# EAGLE design festBin (EAGLE 6.3)
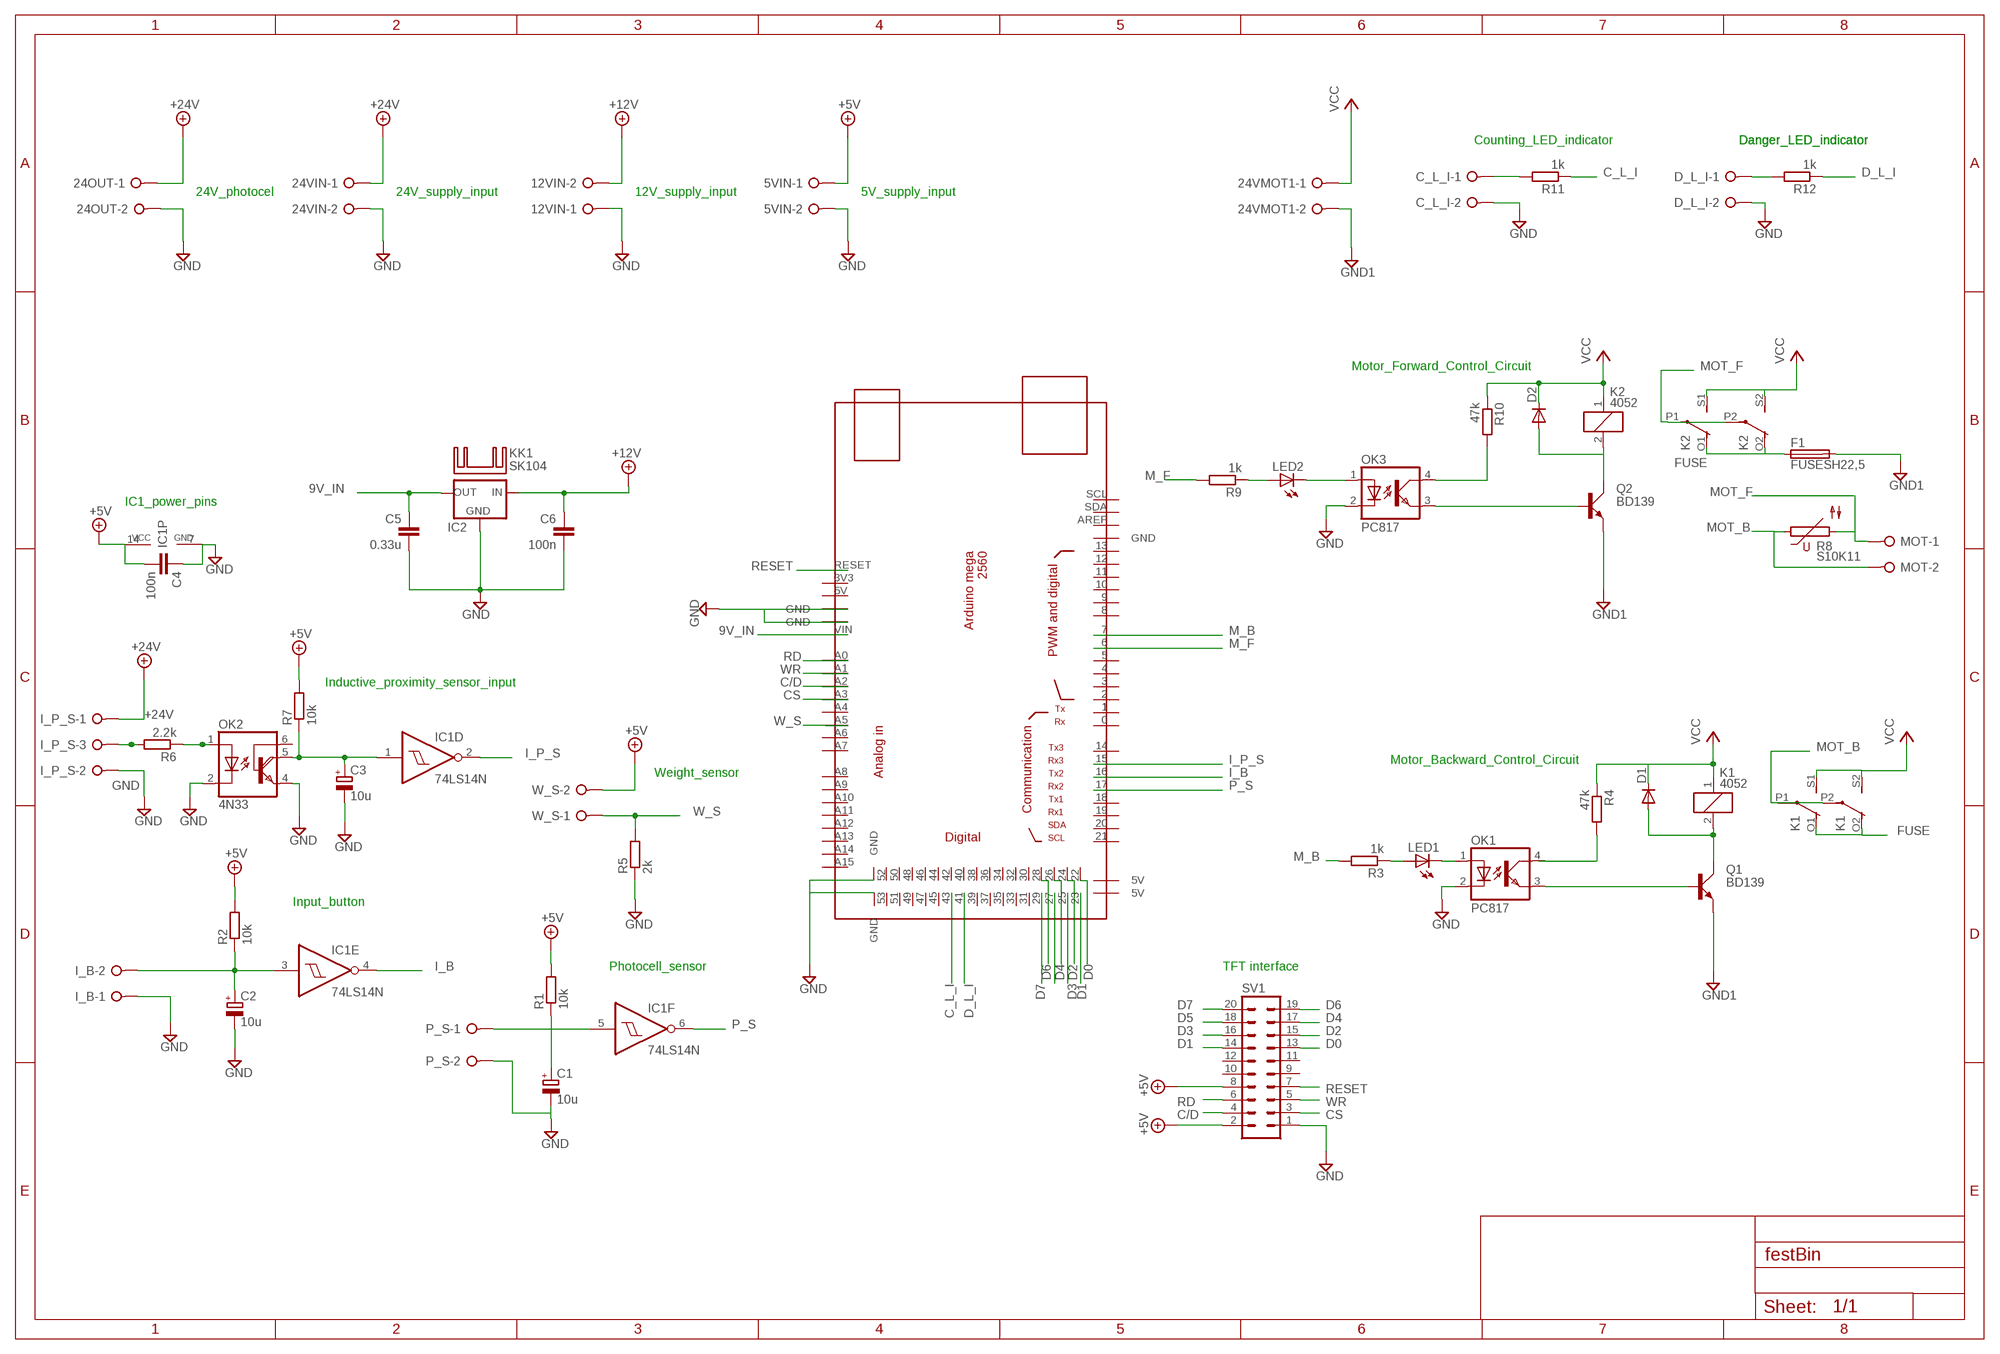
[diagram p0: schematic, sheet 1]

## Parts
5VIN  W237-02P  [W237-132]
12VIN  W237-02P  [W237-132]
24OUT  W237-02P  [W237-132]
24VIN  W237-02P  [W237-132]
24VMOT1  W237-02P  [W237-132]
C1  10u  CPOL-EUE2.5-6  [E2,5-6]
C2  10u  CPOL-EUE2.5-6  [E2,5-6]
C3  10u  CPOL-EUE2.5-6  [E2,5-6]
C4  100n  C-EU050-024X044  [C050-024X044]
C5  0.33u  C-EU050-024X044  [C050-024X044]
C6  100n  C-EU050-024X044  [C050-024X044]
C_L_I  W237-02P  [W237-132]
D1  DIODE-DO41-10  [DO41-10]
D2  DIODE-DO41-10  [DO41-10]
D_L_I  W237-02P  [W237-132]
F1  FUSESH22,5  [SH22,5]
I_B  W237-02P  [W237-132]
I_P_S  W237-3E  [W237-3E]
IC1  74LS14N  [DIL14]
IC2  78XXS  [78XXS]
K1  4052  [F4052]
K2  4052  [F4052]
KK1  SK104  [SK104]
LED1  LED3MM  [LED3MM]
LED2  LED3MM  [LED3MM]
MOT  W237-02P  [W237-132]
OK1  PC817  [DIL04]
OK2  4N33  [DIL06]
OK3  PC817  [DIL04]
P_S  W237-02P  [W237-132]
Q1  BD139  [TO126AV]
Q2  BD139  [TO126AV]
R1  10k  R-EU_0207/10  [0207/10]
R2  10k  R-EU_0207/10  [0207/10]
R3  1k  R-EU_0207/10  [0207/10]
R4  47k  R-EU_0207/10  [0207/10]
R5  2k  R-EU_0207/10  [0207/10]
R6  2.2k  R-EU_0207/10  [0207/10]
R7  10k  R-EU_0207/10  [0207/10]
R8  S10K11  [S10K11]
R9  1k  R-EU_0207/10  [0207/10]
R10  47k  R-EU_0207/10  [0207/10]
R11  1k  R-EU_0207/10  [0207/10]
R12  1k  R-EU_0207/10  [0207/10]
SV1  ML20  [ML20]
U$1  MEGA_DEVICE  [MEGABOX]
W_S  W237-02P  [W237-132]

## Nets
9V_IN: C5.1 IC2.OUT U$1.VIN
+5V: 5VIN.1 C4.2 IC1.14(P:VCC) R1.2 R2.2 R7.2 SV1.2 SV1.8 W_S.2
+12V: 12VIN.2 C6.1 IC2.IN
+24V: 24OUT.1 24VIN.1 I_P_S.1
C/D: SV1.4 U$1.A2
C_L_I: R11.1 U$1.43
CS: SV1.3 U$1.A3
D0: SV1.13 U$1.22
D1: SV1.14 U$1.23
D2: SV1.15 U$1.24
D3: SV1.16 U$1.25
D4: SV1.17 U$1.26
D5: SV1.18 U$1.27
D6: SV1.19 U$1.28
D7: SV1.20 U$1.29
D_L_I: R12.1 U$1.41
FUSE: F1.1 K1.O1(2:O) K1.O2(3:O) K2.O1(2:O) K2.O2(3:O)
GND: 5VIN.2 12VIN.1 24OUT.2 24VIN.2 C1.- C2.- C3.- C4.1 C5.2 C6.2 C_L_I.2 D_L_I.2 I_B.1 I_P_S.2 IC1.7(P:GND) IC2.GND OK1.2(C) OK2.2(C) OK2.4(E) OK3.2(C) P_S.2 R5.1 SV1.1 U$1.GND@2(GND) U$1.GND@3(GND) U$1.GND@6(GND) U$1.GND@7(GND)
GND1: 24VMOT1.2 F1.2 Q1.E Q2.E
I_B: IC1.4(E:O) U$1.16
I_P_S: IC1.2(D:O) U$1.15
M_B: R3.2 U$1.7
M_F: R9.2 U$1.6
MOT_B: K1.P1(2:P) K1.P2(3:P) MOT.2 R8.1
MOT_F: K2.P1(2:P) K2.P2(3:P) MOT.1 R8.2
N$1: I_P_S.3 R6.2
N$2: C1.+ IC1.5(F:I) P_S.1 R1.1
N$3: C_L_I.1 R11.2
N$4: D_L_I.1 R12.2
N$5: C2.+ I_B.2 IC1.3(E:I) R2.1
N$6: LED2.A R9.1
N$7: LED1.A R3.1
N$10: OK3.4(COL) R10.2
N$11: OK1.3(EMIT) Q1.B
N$12: D2.A K2.2 Q2.C
N$18: LED1.K(C) OK1.1(A)
N$19: LED2.K(C) OK3.1(A)
N$21: OK1.4(COL) R4.2
N$23: D1.A K1.2 Q1.C
N$24: OK3.3(EMIT) Q2.B
N$25: OK2.1(A) R6.1
N$26: C3.+ IC1.1(D:I) OK2.5(COL) R7.1
P_S: IC1.6(F:O) U$1.17
RD: SV1.6 U$1.A0
RESET: SV1.7 U$1.RESET
VCC: 24VMOT1.1 D1.C D2.C K1.1 K1.S1(2:S) K1.S2(3:S) K2.1 K2.S1(2:S) K2.S2(3:S) R4.1 R10.1
W_S: R5.2 U$1.A5 W_S.1
WR: SV1.5 U$1.A1
Unconnected: IC1.8(C:O) IC1.9(C:I) IC1.10(B:O) IC1.11(B:I) IC1.12(A:O) IC1.13(A:I) OK2.6(B) SV1.9 SV1.10 SV1.11 SV1.12 U$1.0 U$1.1 U$1.2 U$1.3 U$1.3V3 U$1.4 U$1.5 U$1.5V U$1.8 U$1.9 U$1.10 U$1.11 U$1.12 U$1.13 U$1.14 U$1.18 U$1.19 U$1.20 U$1.21 U$1.30 U$1.31 U$1.32 U$1.33 U$1.34 U$1.35 U$1.36 U$1.37 U$1.38 U$1.39 U$1.40 U$1.42 U$1.44 U$1.45 U$1.46 U$1.47 U$1.48 U$1.49 U$1.50 U$1.51 U$1.52 U$1.53 U$1.A4 U$1.A6 U$1.A7 U$1.A8 U$1.A9 U$1.A10 U$1.A11 U$1.A12 U$1.A13 U$1.A14 U$1.A15 U$1.AREF U$1.GND@1(GND) U$1.GND@4(5V) U$1.GND@5(5V) U$1.SCL U$1.SDA

## Notes on the sheet
- Counting_LED_indicator | Danger_LED_indicator | Danger_LED_indicator
- 24V_photocel | 24V_supply_input | 12V_supply_input | 5V_supply_input
- Motor_Forward_Control_Circuit
- IC1_power_pins
- Inductive_proximity_sensor_input
- Motor_Backward_Control_Circuit
- Weight_sensor
- Input_button
- Photocell_sensor | TFT interface

## Library data of the parts
5VIN 12VIN 24OUT 24VIN 24VMOT1 C_L_I D_L_I I_B MOT P_S W_S = con-wago-508:W237-02P: WAGO SREW CLAMP; OC_FARNELL: unknown; OC_NEWARK: unknown
C1-C3 = rcl:CPOL-EU: POLARIZED CAPACITOR, European symbol
C4-C6 = rcl:C-EU: CAPACITOR, European symbol
D1 D2 = diode:DIODE-: DIODE
F1 = fuse:FUSE: Fuse; OC_FARNELL: unknown; OC_NEWARK: unknown
I_P_S = con-wago-508:W237-3E: WAGO SREW CLAMP; OC_FARNELL: unknown; OC_NEWARK: unknown
IC1 = 74xx-eu:74*14: Hex schmitt trigger INVERTER
IC2 = v-reg:78XXS: VOLTAGE REGULATOR
K1 K2 = relay:4052: RELAY 2 x switch, Finder; OC_FARNELL: unknown; OC_NEWARK: unknown
KK1 = heatsink:SK104: HEATSINK manufacturer Fischer/distributor Buerklin
LED1 LED2 = led:LED: LED OSRAM: - CHIPLED LG R971, LG N971, LY N971, LG Q971, LY Q971, LO R971, LY R971 LH N974, LH R974 LS Q976, LO Q976, LY Q976 LO Q996 - Hyper CHIPLED LW Q18S LB Q993, LB Q99A, LB R99A - SideLED LS A670, LO A670, LY A670, LG A670, LP A670 LB A673, LV A673, LT A673, LW A673 LH A674 LY A675 LS A676, LA A676, LO A676, LY A676, LW A676 LS A679, LY A679, LG A679 - Hyper Micro SIDELED® LS Y876, LA Y876, LO Y876, LY Y876 LT Y87S - SmartLED LW L88C, LW L88S LB L89C, LB L89S, LG L890 LS L89K, LO L89K, LY L89K LS L896, LA L896, LO L896, LY L896 - TOPLED LS T670, LO T670, LY T670, LG T670, LP T670 LSG T670, LSP T670, LSY T670, LOP T670, LYG T670 LG T671, LOG T671, LSG T671 LB T673, LV T673, LT T673, LW T673 LH T674 LS T676, LA T676, LO T676, LY T676, LB T676, LH T676, LSB T676, LW T676 LB T67C, LV T67C, LT T67C, LS T67K, LO T67K, LY T67K, LW E67C LS E67B, LA E67B, LO E67B, LY E67B, LB E67C, LV E67C, LT E67C LW T67C LS T679, LY T679, LG T679 LS T770, LO T770, LY T770, LG T770, LP T770 LB T773, LV T773, LT T773, LW T773 LH T774 LS E675, LA E675, LY E675, LS T675 LS T776, LA T776, LO T776, LY T776, LB T776 LHGB T686 LT T68C, LB T68C - Hyper Mini TOPLED® LB M676 - Mini TOPLED Santana® LG M470 LS M47K, LO M47K, LY M47K Source: http://www.osram.convergy.de LUXEON: - LUMILED® LXK2-PW12-R00, LXK2-PW12-S00, LXK2-PW14-U00, LXK2-PW14-V00 LXK2-PM12-R00, LXK2-PM12-S00, LXK2-PM14-U00 LXK2-PE12-Q00, LXK2-PE12-R00, LXK2-PE12-S00, LXK2-PE14-T00, LXK2-PE14-U00 LXK2-PB12-K00, LXK2-PB12-L00, LXK2-PB12-M00, LXK2-PB14-N00, LXK2-PB14-P00, LXK2-PB14-Q00 LXK2-PR12-L00, LXK2-PR12-M00, LXK2-PR14-Q00, LXK2-PR14-R00 LXK2-PD12-Q00, LXK2-PD12-R00, LXK2-PD12-S00 LXK2-PH12-R00, LXK2-PH12-S00 LXK2-PL12-P00, LXK2-PL12-Q00, LXK2-PL12-R00 Source: www.luxeon.com KINGBRIGHT: KA-3528ASYC Source: www.kingbright.com
OK1 OK3 = optocoupler:PC817: SHARP OPTO COUPLER; MPN: PC817X4J000F; OC_FARNELL: 9707727; OC_NEWARK: 97K7059
OK2 = optocoupler:4N33: MOTOROLA OPTO COUPLER; MF: VISHAY/TELEFUNKEN; MPN: 4N33; OC_FARNELL: 1469601; OC_NEWARK: 88K1390
Q1 Q2 = transistor-power:BD139: NPN TRANSISTOR
R1-R7 R9-R12 = rcl:R-EU_: RESISTOR, European symbol
R8 = varistor:S10K11: VARISTOR
SV1 = N__con-harting-ml:ML20: HARTING; OC_FARNELL: unknown; OC_NEWARK: unknown
U$1 = ArduinoMegaSymbol:MEGA_DEVICE: mega card as device

## Board
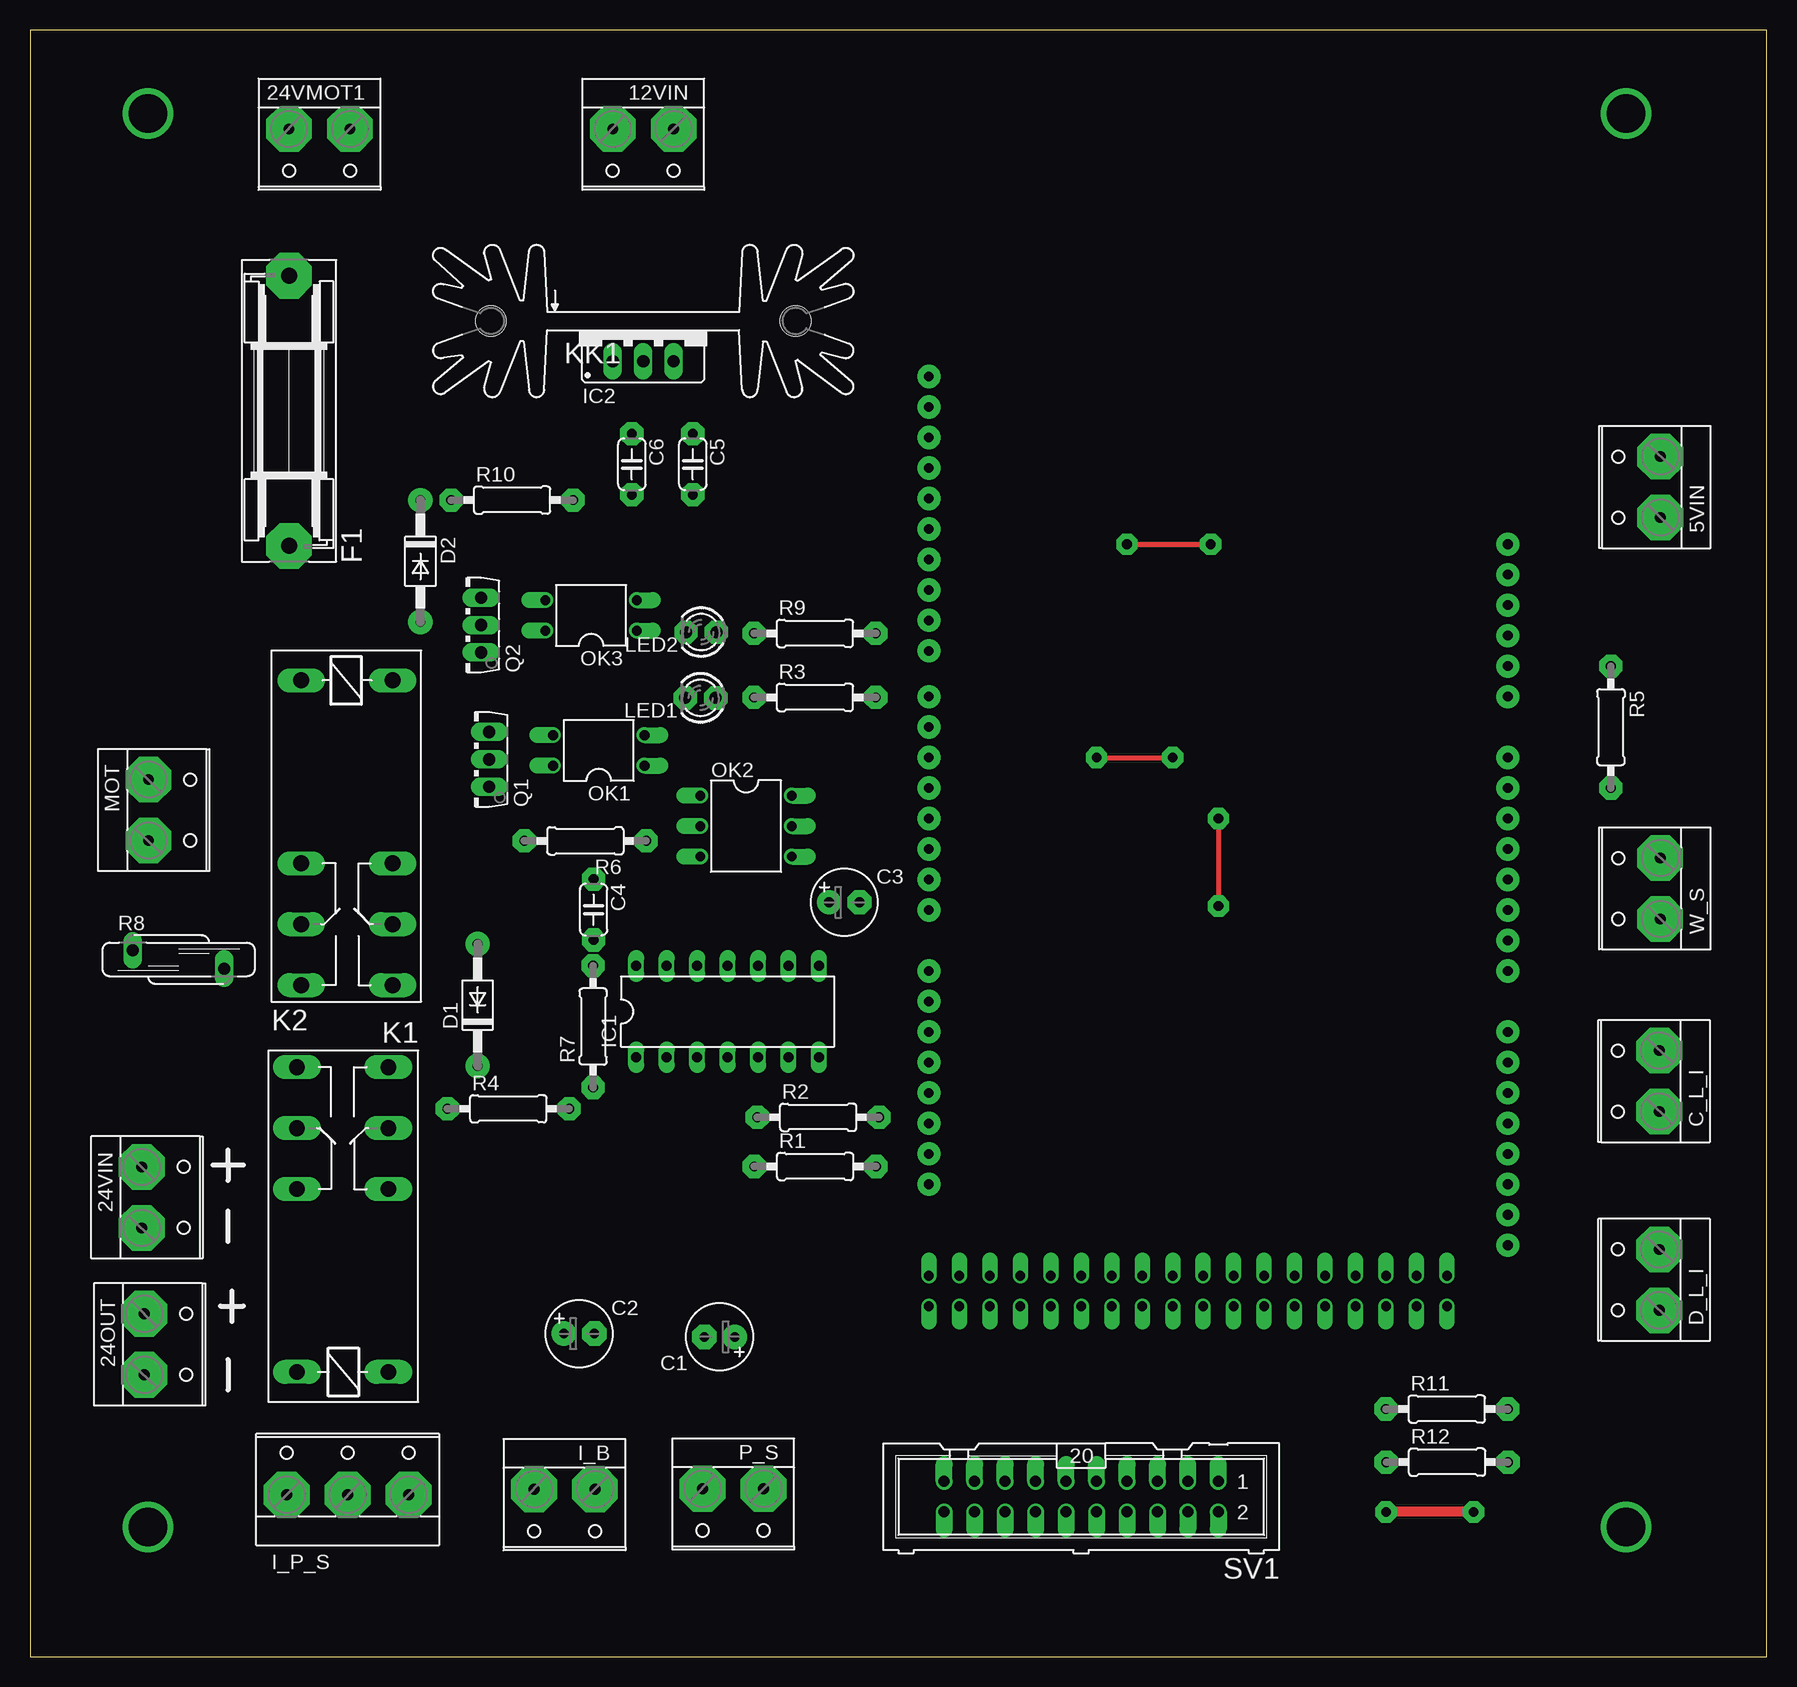
[diagram p1: board, top side]
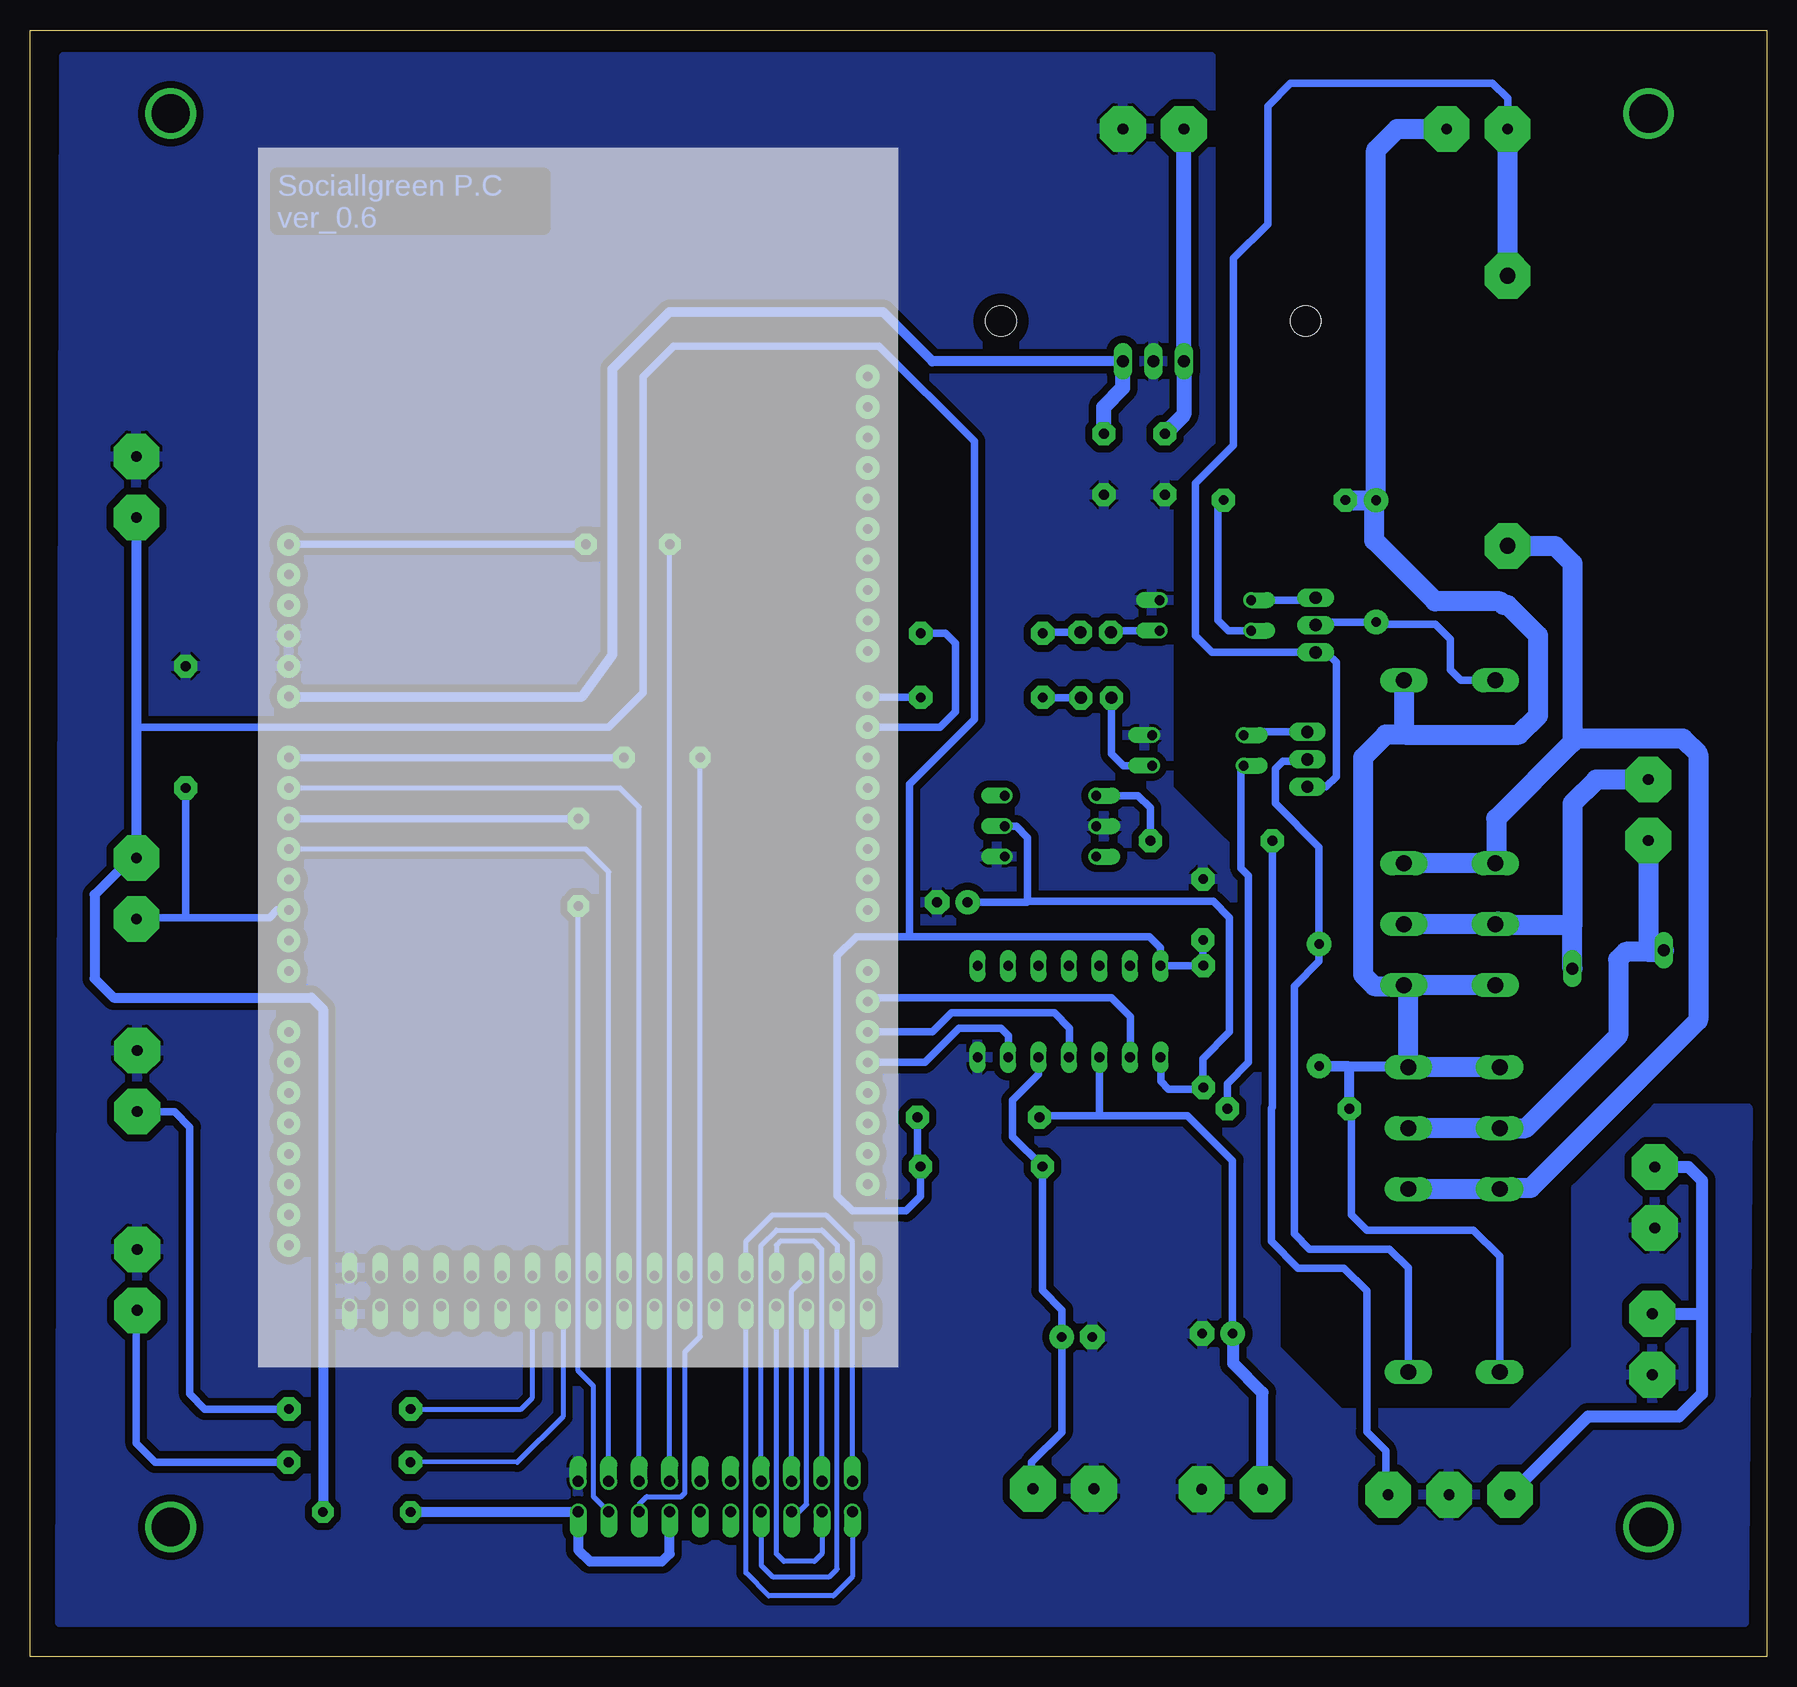
[diagram p2: board, bottom side, seen from below]

Size 144.76 x 135.56 mm. Coordinates in mm from the lower left corner, seen from the top.
Outline: 0,0 144.76,0 144.76,135.56 0,135.56 0,0
Copper layers (1*16): Top 0.035mm / dielectric 1.5mm / Bottom 0.035mm
Design rules "default": minimum track width 10mil, minimum drill 24mil, track to track 8mil, track to pad 8mil, pad to pad 8mil, via to via 8mil, smd to smd 8mil, copper to edge 40mil, drill to drill 8mil, minimum pad ring 10mil, minimum via ring 8mil, stop-mask expansion 4mil, vias tented up to drill 0mil, thermal gap 10mil

### Footprints (pad centres in the part's own frame; a part is rotated, then mirrored left to right if it is on the bottom)
W237-132 = drill 0.9 pad 3.81 octagon: 1 -2.54,-0.635; 2 2.54,-0.635
E2,5-6 = drill 0.813 pad 2.032: + -1.27,0 | drill 0.813 pad 2.032 octagon: - 1.27,0
C050-024X044 = drill 0.813 pad 1.93 octagon: 1 -2.54,0; 2 2.54,0
DO41-10 = drill 0.8 pad 2.032: A 5.08,0; C -5.08,0
SH22,5 = drill 1.321 pad 3.81 octagon: 1 -11.252,0; 2 11.252,0
W237-3E = drill 0.9 pad 3.81 octagon: 1 -5.08,-0.635; 2 0,-0.635; 3 5.08,-0.635
DIL14 = drill 0.813 long: 1 -7.62,-3.81; 2 -5.08,-3.81; 3 -2.54,-3.81; 4 0,-3.81; 5 2.54,-3.81; 6 5.08,-3.81; 7 7.62,-3.81; 8 7.62,3.81; 9 5.08,3.81; 10 2.54,3.81; 11 0,3.81; 12 -2.54,3.81; 13 -5.08,3.81; 14 -7.62,3.81
78XXS = drill 1.016 long: GND 0,-2.54; IN -2.54,-2.54; OUT 2.54,-2.54
F4052 = drill 1.321 long: 1 -3.81,3.81; 2 -3.81,-3.81; O1 11.43,-3.81; O2 11.43,3.81; P1 16.51,-3.81; P2 16.51,3.81; S1 21.59,-3.81; S2 21.59,3.81
SK104 = hole 2.54: -12.7,-0.762; 12.7,-0.762
LED3MM = drill 1 pad 1.93 octagon: A -1.27,0; K 1.27,0
DIL04 = drill 0.813 offset: 1 -1.27,-3.81; 2 1.27,-3.81; 3 1.27,3.81; 4 -1.27,3.81
DIL06 = drill 0.813 offset: 1 -2.54,-3.81; 2 0,-3.81; 3 2.54,-3.81; 4 2.54,3.81; 5 0,3.81; 6 -2.54,3.81
TO126AV = drill 1.016 long: B 2.286,-1.27; C 0,-1.27; E -2.286,-1.27
0207/10 = drill 0.813 pad 1.93 octagon: 1 -5.08,0; 2 5.08,0
S10K11 = drill 1.016 long: 1 -0.762,-3.81; 2 0.762,3.81
ML20 = drill 0.914 pad 1.27 offset: 1 -11.43,-1.27; 2 -11.43,1.27; 3 -8.89,-1.27; 4 -8.89,1.27; 5 -6.35,-1.27; 6 -6.35,1.27; 7 -3.81,-1.27; 8 -3.81,1.27; 9 -1.27,-1.27; 10 -1.27,1.27; 11 1.27,-1.27; 12 1.27,1.27; 13 3.81,-1.27; 14 3.81,1.27; 15 6.35,-1.27; 16 6.35,1.27; 17 8.89,-1.27; 18 8.89,1.27; 19 11.43,-1.27; 20 11.43,1.27
MEGABOX = drill 0.8 pad 1.93: 0 24.13,-7.62; 1 24.13,-5.08; 2 24.13,-2.54; 3 24.13,0; 3V3 -24.13,20.32; 4 24.13,2.54; 5 24.13,5.08; 5V -24.13,17.78; 6 24.13,7.62; 7 24.13,10.16; 8 24.13,13.97; 9 24.13,16.51; 10 24.13,19.05; 11 24.13,21.59; 12 24.13,24.13; 13 24.13,26.67; 14 24.13,-12.7; 15 24.13,-15.24; 16 24.13,-17.78; 17 24.13,-20.32; 18 24.13,-22.86; 19 24.13,-25.4; 20 24.13,-27.94; 21 24.13,-30.48; A0 -24.13,5.08; A1 -24.13,2.54; A2 -24.13,0; A3 -24.13,-2.54; A4 -24.13,-5.08; A5 -24.13,-7.62; A6 -24.13,-10.16; A7 -24.13,-12.7; A8 -24.13,-17.78; A9 -24.13,-20.32; A10 -24.13,-22.86; A11 -24.13,-25.4; A12 -24.13,-27.94; A13 -24.13,-30.48; A14 -24.13,-33.02; A15 -24.13,-35.56; AREF 24.13,31.75; GND@1 24.13,29.21; GND@2 -24.13,15.24; GND@3 -24.13,12.7; RESET -24.13,22.86; SCL 24.13,36.83; SDA 24.13,34.29; VIN -24.13,10.16 | drill 0.8 pad 1.27 offset: 22 21.59,-38.1; 23 21.59,-40.64; 24 19.05,-38.1; 25 19.05,-40.64; 26 16.51,-38.1; 27 16.51,-40.64; 28 13.97,-38.1; 29 13.97,-40.64; 30 11.43,-38.1; 31 11.43,-40.64; 32 8.89,-38.1; 33 8.89,-40.64; 34 6.35,-38.1; 35 6.35,-40.64; 36 3.81,-38.1; 37 3.81,-40.64; 38 1.27,-38.1; 39 1.27,-40.64; 40 -1.27,-38.1; 41 -1.27,-40.64; 42 -3.81,-38.1; 43 -3.81,-40.64; 44 -6.35,-38.1; 45 -6.35,-40.64; 46 -8.89,-38.1; 47 -8.89,-40.64; 48 -11.43,-38.1; 49 -11.43,-40.64; 50 -13.97,-38.1; 51 -13.97,-40.64; 52 -16.51,-38.1; 53 -16.51,-40.64; GND@4 24.13,-38.1; GND@5 24.13,-40.64; GND@6 -19.05,-38.1; GND@7 -19.05,-40.64

### Placement (x,y rotation side)
5VIN  135.25,97.47 90 top
12VIN  51.12,126.68 180 top
24OUT  10.16,26.04 270 top
24VIN  9.95,38.27 270 top
24VMOT1  24.13,126.68 180 top
C1  57.49,26.65 180 top
C2  45.78,26.93 0 top
C3  67.88,62.87 0 top
C4  46.98,62.26 270 top
C5  55.24,99.38 270 top
C6  50.16,99.38 270 top
C_L_I  135.19,47.97 90 top
D1  37.31,54.3 90 top
D2  32.54,91.3 270 top
D_L_I  135.19,31.4 90 top
F1  21.59,103.82 90 top
I_B  44.55,13.32 180 top
I_P_S  26.48,14.13 0 top
IC1  58.15,53.76 0 top
IC2  51.12,110.49 0 top
K1  26.06,27.54 90 top
K2  26.42,77.55 270 top
KK1  51.12,112.08 0 top
LED1  55.89,79.89 180 top
LED2  55.95,85.38 180 top
MOT  10.51,70.56 270 top
OK1  47.41,75.53 90 top
OK2  59.69,69.22 270 top
OK3  46.77,86.77 90 top
P_S  58.61,13.36 180 top
Q1  37.01,74.78 90 top
Q2  36.32,85.97 90 top
R1  65.45,40.85 0 top
R2  65.7,44.95 0 top
R3  65.43,79.94 0 top
R4  39.87,45.66 0 top
R5  131.78,77.47 270 top
R6  46.28,67.99 180 top
R7  46.94,52.51 90 top
R8  12.38,58.1 270 top
R9  65.43,85.28 0 top
R10  40.19,96.39 0 top
R11  118.1,20.64 0 top
R12  118.12,16.21 0 top
SV1  87.63,13.34 180 top
U$1  99.06,69.85 0 bottom
W_S  135.25,64.02 90 top

### Tracks (layer width: path | path; a pad name or v marks a point on that pad's centre or on a via)
9V_IN
  Bottom 0.813: U$1.VIN 98.74,80.01 96.2,83.5 96.2,107.31 91.44,112.08 73.66,112.08 69.53,107.95 IC2.OUT
  Bottom 1.27: C5.1 55.24,104.14 53.66,105.73 IC2.OUT
+5V  (via drill 0.8 pad 1.78)
  Top 0.813: v120.33,12.06 v113.03,12.06
  Bottom 0.61: C4.2 46.98,57.63 R7.2 50.51,57.59 IC1.14 50.53,59.1 51.43,60.01 71.44,60.01 | R2.2 70.78,41.1 R1.2 70.53,38.37 71.76,37.15 76.2,37.15 77.47,38.42 77.47,58.42 75.88,60.01 71.44,60.01 | 71.44,60.01 71.44,72.71 66.04,78.11 66.04,101.28 73.98,109.22 91.12,109.22 93.66,106.68 93.66,80.33 96.52,77.47 135.89,77.47
  Bottom 0.813: 5VIN.1 135.89,77.47 W_S.2 136.33,66.56 139.38,63.5 139.38,56.52 137.8,54.93 121.29,54.93 120.33,53.98 v120.33,12.06 | SV1.8 91.44,8.57 92.07,7.94 98.11,7.94 99.06,8.89 SV1.2 v113.03,12.06
+12V
  Bottom 1.27: 12VIN.2 IC2.IN 48.58,103.5 C6.1
+24V
  Bottom 1.016: 24VIN.1 6.53,40.81 5.4,39.69 5.4,28.57 | 24OUT.1 5.4,28.57 | 5.4,28.57 5.4,21.91 7.3,20 14.89,20 I_P_S.1
C/D  (via drill 0.8 pad 1.78)
  Top 0.406: v99.06,69.85 v99.06,62.55
  Bottom 0.406: SV1.4 97.79,13.34 97.79,22.54 99.06,23.81 v99.06,62.55
  Bottom 0.61: U$1.A2 v99.06,69.85
C_L_I
  Bottom 0.406: R11.1 103.82,20.64 102.87,21.59 U$1.43
CS
  Bottom 0.406: SV1.3 96.52,65.41 98.43,67.31 U$1.A3
D0
  Bottom 0.406: SV1.13 83.82,34.29 82.55,35.56 78.74,35.56 77.47,34.29 U$1.22
D1
  Bottom 0.406: SV1.14 83.82,7.62 82.87,6.67 78.1,6.67 77.47,7.3 U$1.23
D2
  Bottom 0.406: SV1.15 81.28,30.48 U$1.24
D3
  Bottom 0.406: SV1.16 80.65,12.06 80.01,12.7 U$1.25
D4
  Bottom 0.406: SV1.17 78.74,33.97 79.37,34.61 82.23,34.61 82.55,34.29 U$1.26
D5
  Bottom 0.406: SV1.18 78.74,8.57 79.37,7.94 81.92,7.94 82.55,8.57 U$1.27
D6
  Bottom 0.406: SV1.19 76.2,34.61 78.42,36.83 82.87,36.83 85.09,34.61 U$1.28
D7
  Bottom 0.406: SV1.20 76.2,6.67 77.79,5.08 83.18,5.08 85.09,6.99 U$1.29
D_L_I
  Bottom 0.406: U$1.41 100.33,20 104.14,16.19 113.03,16.23 R12.1
FUSE
  Bottom 1.676: F1.1 17.64,92.57 16.19,91.12 16.19,76.2 | 22.53,66.04 K2.O1 | K2.O1 K2.O2 | K1.O1 K1.O2 22.17,39.05 19.69,39.05 5.71,53.02 5.71,75.25 6.99,76.52 15.87,76.52 16.19,76.2 | 16.19,76.2 22.54,69.85 22.54,66.19 K2.O1
GND
  pour Bottom (isolate 0.61): 46.35,133.35 46.35,101.28 49.85,97.79 49.85,72.39 40.96,63.5 40.96,25.72 35.56,20.32 21.27,20.32 15.87,25.72 15.87,39.05 9.21,45.72 1.59,45.72 1.91,2.86 142.24,2.86 141.92,133.35
GND1
  Bottom 0.61: Q1.E 36.73,72.49 35.88,73.34 35.88,82.87 36.51,83.5 37.41,83.5 Q2.E 46.22,83.69 47.63,85.09 47.63,97.79 44.45,100.97 44.45,116.52 41.59,119.38 41.59,129.22 39.69,131.13 22.86,131.13 21.59,129.86 24VMOT1.2
  Bottom 1.676: F1.2 24VMOT1.2
I_B
  Bottom 0.61: U$1.16 69.53,52.07 67.95,53.66 59.37,53.66 58.1,52.39 58.1,50.23 IC1.4
I_P_S
  Bottom 0.61: IC1.2 53.02,50 53.02,53.34 54.61,54.93 73.98,54.93 74.29,54.61 U$1.15
M_B
  Bottom 0.61: R3.2 74.87,79.94 U$1.7
M_F
  Bottom 0.61: R9.2 68.45,85.28 67.63,84.45 67.63,78.74 68.9,77.47 U$1.6
MOT_B
  Bottom 1.676: K1.P1 K1.P2 20.08,44.05 12.38,51.75 12.38,58.1 11.75,58.74 9.84,58.74 | MOT.2 9.87,58.77 9.84,58.74 | 9.84,58.74 8.7,58.74 R8.1 9.72,58.86 9.84,58.74
MOT_F
  Bottom 1.676: 22.37,61.28 K2.P1 | K2.P1 K2.P2 | MOT.1 14.22,73.1 16.19,71.12 16.19,60.96 | 16.19,60.96 22.53,60.96 K2.P1 | R8.2 16.19,60.96
N$1
  Bottom 0.61: R6.2 41.21,45.79 41.28,45.72 41.28,34.61 39.05,32.38 35.24,32.38 33.34,30.48 33.34,18.73 31.75,17.14 31.75,13.7 I_P_S.3
N$2
  Bottom 0.61: IC1.5 60.69,48.53 62.86,46.35 62.86,43.35 R1.1 60.37,30.52 58.74,28.89 58.74,26.67 C1.+ 58.76,18.71 61.28,16.19 61.28,14.13 P_S.1
N$3
  Bottom 0.406: 135.79,45.4 C_L_I.1
  Bottom 0.61: R11.2 130.18,20.64 131.44,21.91 131.44,44.13 132.71,45.4 135.79,45.4
N$4
  Bottom 0.406: 135.89,28.79 D_L_I.1
  Bottom 0.61: R12.2 134.33,16.21 135.89,17.78 135.89,28.79
N$5
  Bottom 0.61: C2.+ 44.51,41.34 48.26,45.09 55.56,45.09 | 55.56,45.09 60.49,45.09 R2.1 | IC1.3 55.61,45.13 55.56,45.09
  Bottom 1.016: I_B.2 42.01,22.01 44.45,24.45 44.45,26.87 C2.+
N$6
  Bottom 0.61: LED2.A 60.25,85.38 R9.1
N$7
  Bottom 0.61: LED1.A 60.29,79.89 R3.1
N$8  (via drill 3.2 pad 3.81)
  other vias: 9.84,10.79
N$9  (via drill 3.2 pad 3.81)
  other vias: 133.03,10.79
N$10
  Bottom 0.61: OK3.4 44.86,85.5 45.72,86.36 45.72,95.93 R10.2
N$11
  Bottom 0.61: Q1.B 43.33,77.06 OK1.3
N$12
  Bottom 0.61: K2.2 25.48,81.36 26.35,82.23 26.35,84.77 27.62,86.04 32.37,86.04 D2.A 37.35,86.22 Q2.C
N$13  (via drill 3.2 pad 3.81)
  other vias: 133.03,128.59
N$14  (via drill 3.2 pad 3.81)
  other vias: 9.84,128.59
N$18
  Bottom 0.61: OK1.1 53.62,74.25 54.61,75.25 54.61,79.88 LED1.K
N$19
  Bottom 0.61: OK3.1 54.55,85.5 LED2.K
N$21
  Bottom 0.61: R4.2 44.95,47.76 43.18,49.53 43.18,65.09 43.82,65.72 43.82,74.04 OK1.4
N$23
  Bottom 0.61: K1.2 29.87,32.41 31.43,33.97 38.1,33.97 39.37,35.24 39.37,55.88 37.31,57.94 D1.A 37.31,67.47 40.96,71.12 40.96,73.98 40.32,74.61 38.44,74.61 Q1.C
N$24
  Bottom 0.61: OK3.3 37.81,88.04 Q2.B
N$25
  Bottom 0.61: R6.1 51.36,70.73 52.39,71.75 OK2.1
N$26
  Bottom 0.61: OK2.5 62.55,69.22 61.6,68.26 61.6,62.94 | C3.+ 61.67,62.87 61.6,62.94 | 61.6,62.94 46.11,62.94 44.77,61.59 44.77,52.07 46.99,49.85 46.99,47.48 | 46.99,47.48 R7.1 | 46.99,47.48 46.99,47.31 49.85,47.31 50.48,47.94 50.48,49.91 IC1.1
P_S
  Bottom 0.61: U$1.17 70.17,49.53 67.31,52.39 63.82,52.39 63.18,51.75 63.18,50 IC1.6
RD  (via drill 0.8 pad 1.78)
  Top 0.406: v88.9,74.93 v95.25,74.93
  Bottom 0.406: SV1.6 93.98,12.7 93.34,13.34 90.49,13.34 90.17,13.65 90.17,25.4 88.9,26.67 v88.9,74.93
  Bottom 0.61: v95.25,74.93 U$1.A0
RESET  (via drill 0.8 pad 1.78)
  Top 0.406: v91.44,92.71 v98.43,92.71
  Bottom 0.406: SV1.7 v91.44,92.71
  Bottom 0.61: v98.43,92.71 U$1.RESET
VCC
  Bottom 0.61: K1.1 22.25,33.37 24.45,35.56 33.34,35.56 34.61,36.83 34.61,45.48 R4.1
  Bottom 0.813: R4.1 34.79,49.08 34.92,49.21 D1.C 29.96,49.22 K1.S1
  Bottom 1.676: R10.1 32.56,96.39 | 32.56,96.39 D2.C 32.7,96.22 32.7,93.03 27.62,87.95 22.23,87.95 21.91,87.63 21.59,87.63 19.05,85.09 19.05,78.42 20.64,76.83 30.16,76.83 | K2.1 30.23,76.91 30.16,76.83 | 32.56,96.39 32.56,125.56 30.8,127.32 24VMOT1.1 | K2.S1 K2.S2 | 30.16,76.83 31.75,76.83 33.65,74.93 33.65,56.83 32.7,55.88 30.31,55.88 K2.S2 | K2.S2 29.87,55.6 K1.S1 K1.S2
W_S
  Bottom 0.406: 135.77,61.59 W_S.1 | 131.78,61.61 131.76,61.59
  Bottom 0.61: U$1.A5 124.14,62.23 124.78,61.59 131.76,61.59 135.77,61.59 | R5.2 131.78,61.61
WR
  Bottom 0.406: SV1.5 93.98,70.8 95.57,72.39 U$1.A1

### Text on the board
Bottom: Sociallgreen P.C / ver_0.6